# Altium schematic sheet Power.SchDoc
size A
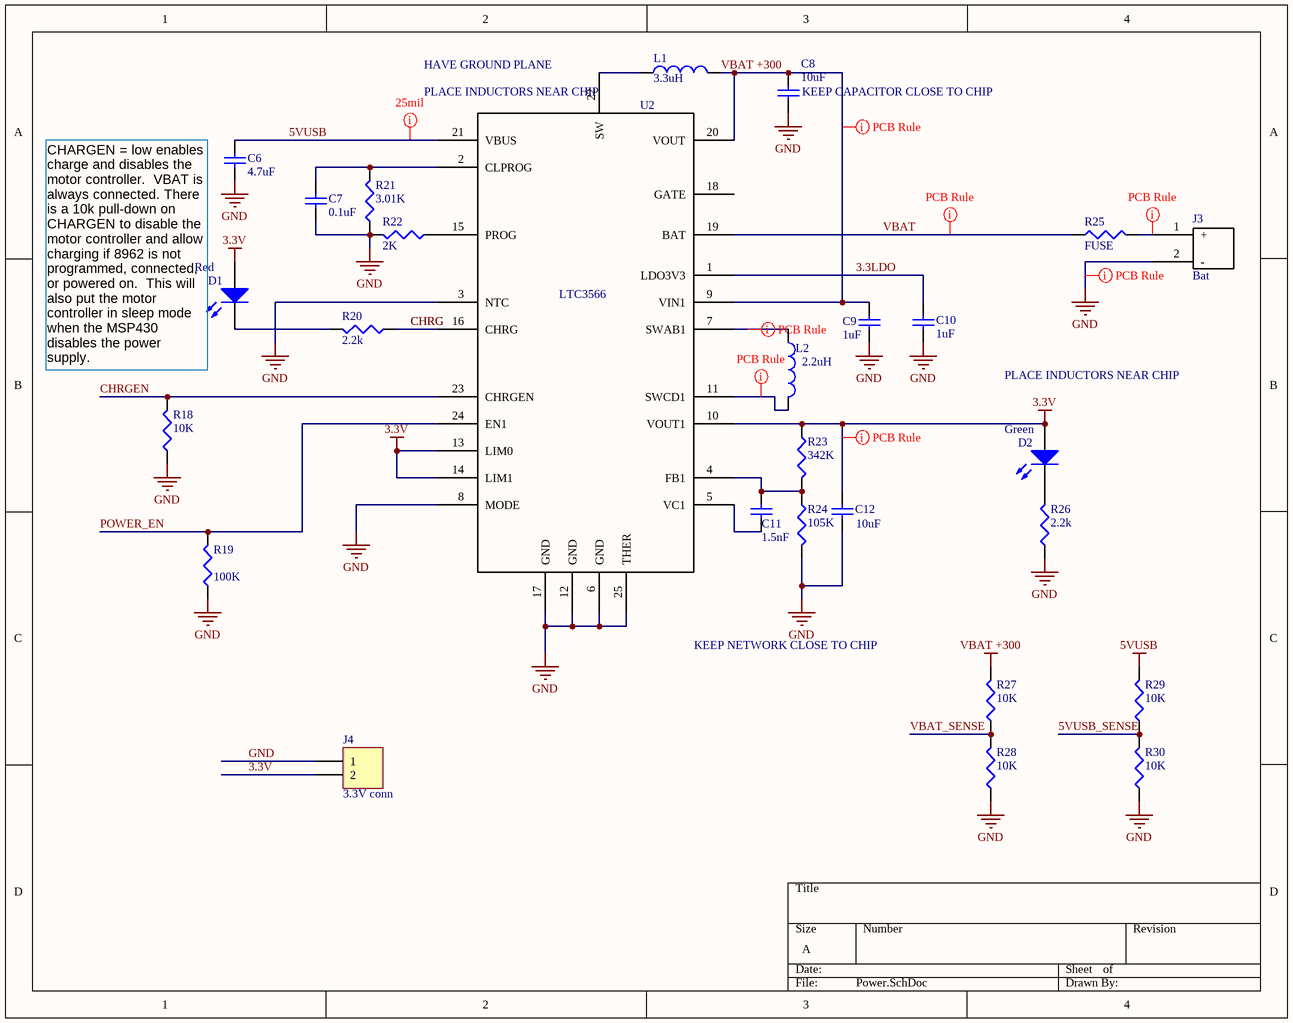
[diagram p0: Power.SchDoc]

## Parts
C6  value 4.7uF  [CAPC1608L]  (hidden comment: Cap)
C7  value 0.1uF  [CAPC1005L]  (hidden comment: Cap)
C8  value 10uF  [CAPC1608L]  (hidden comment: Cap)
C9  value 1uF  [CAPC1608L]  (hidden comment: Cap)
C10  value 1uF  [CAPC1608L]  (hidden comment: Cap)
C11  value 1.5nF  [CAPC1005L]  (hidden comment: Cap)
C12  value 10uF  [CAPC1608L]  (hidden comment: Cap)
D1  Red  [INDC2012L]
D2  Green  [INDC2012L]
J3  Bat  [BatteryConnJST]
J4  3.3V conn  [HDR1X2]
L1  3.3uH  [IndPow]
L2  2.2uH  [IndPow]
R18  value 10K  [RESC1608L]  (hidden comment: Res3)
R19  value 100K  [RESC1608L]  (hidden comment: Res3)
R20  value 2.2k  [RESC1608L]  (hidden comment: Res3)
R21  value 3.01K  [RESC1608L]  (hidden comment: Res3)
R22  value 2K  [RESC1608L]  (hidden comment: Res3)
R23  value 342K  [RESC1608L]  (hidden comment: Res3)
R24  value 105K  [RESC1608L]  (hidden comment: Res3)
R25  value FUSE  [RESC3225L]  (hidden comment: Res3)
R26  value 2.2k  [RESC1608L]  (hidden comment: Res3)
R27  value 10K  [RESC1608L]  (hidden comment: Res3)
R28  value 10K  [RESC1608L]  (hidden comment: Res3)
R29  value 10K  [RESC1608L]  (hidden comment: Res3)
R30  value 10K  [RESC1608L]  (hidden comment: Res3)
U2  LTC3566  [QFN-24]

## Nets
3.3V: C12.2 D1.1(A) D2.1(A) J4.2 R23.1 U2.10(VOUT1) U2.13(LIM0) U2.14(LIM1)
5VUSB: C6.2 R29.2 U2.21(VBUS)
GND: C6.1 C7.1 C8.1 C9.2 C10.2 C12.1 J3.2(-) J4.1 R18.1 R19.1 R21.1 R22.2 R24.2 R26.1 R28.1 R30.1 U2.3(NTC) U2.6(GND) U2.8(MODE) U2.12(GND) U2.17(GND) U2.25(THER)
VBAT +300: C8.2 C9.1 L1.2 R27.2 U2.9(VIN1) U2.20(VOUT)
3.3LDO: C10.1 U2.1(LDO3V3)
5VUSB_SENSE: R29.1 R30.2
CHRG: R20.1 U2.16(CHRG)
CHRGEN: R18.2 U2.23(CHRGEN)
POWER_EN: R19.2 U2.24(EN1)
VBAT: R25.1 U2.19(BAT)
VBAT_SENSE: R27.1 R28.2
NetC7_2: C7.2 R21.2 U2.2(CLPROG)
NetC11_1: C11.1 R23.2 R24.1 U2.4(FB1)
NetC11_2: C11.2 U2.5(VC1)
NetD1_2: D1.2(K) R20.2
NetD2_2: D2.2(K) R26.2
NetJ3_1: J3.1(+) R25.2
NetL1_1: L1.1 U2.22(SW)
NetL2_1: L2.1 U2.7(SWAB1)
NetL2_2: L2.2 U2.11(SWCD1)
NetR22_1: R22.1 U2.15(PROG)

Not connected (* = marked no-connect by the designer): U2 18(GATE)

## Layout directives
rule Width Constraint [Pref Width = 25mil    Min Width = 10mil    Max Width = 25mil]: 5VUSB, GND, NetJ3_1, NetL2_1, NetL2_2, VBAT +300
rule Width Constraint [Pref Width = 25mil    Min Width = 10mil    Max Width = 100mil]: 3.3V
rule Width Constraint [Pref Width = 25mil    Min Width = 10mil    Max Width = 50mil]: VBAT

## Notes on the sheet
- (near U2) HAVE GROUND PLANE
- (near U2) PLACE INDUCTORS NEAR CHIP
- (near C8) KEEP CAPACITOR CLOSE TO CHIP
- CHARGEN = low enables charge and disables the motor controller.  VBAT is always connected. There is a 10k pull-down on CHARGEN to disable the motor controller and allow charging if 8962 is not programmed, connected, or powered on.  This will also put the motor controller in sleep mode when the MSP430 disables the power supply.
- CHRG
- PLACE INDUCTORS NEAR CHIP
- KEEP NETWORK CLOSE TO CHIP

## Library data of the parts
C6-C12 = Cap: Capacitor; Published: 8-Jun-2000; LatestRevisionDate: 17-Jul-2002; LatestRevisionNote: Re-released for DXP Platform.; PackageReference: RAD-0.3; Publisher: Altium Limited
D1 D2 = LED2: Typical RED, GREEN, YELLOW, AMBER GaAs LED; Published: 8-Jun-2000; LatestRevisionDate: 17-Jul-2002; LatestRevisionNote: Re-released for DXP Platform.; PackageVersion: Feb-2002; PackageReference: 3.2X1.6X1.1; Publisher: Altium Limited
J3 = BatteryConnJST
J4 = Header 2: Header, 2-Pin; LatestRevisionDate: 17-Jul-2002; LatestRevisionNote: Re-released for DXP Platform.; Publisher: Altium Limited
L1 L2 = Inductor
  L1: Value: 3.3uH
  L2: Value: 2.2uH
R18-R30 = Res3: Resistor; Published: 8-Jun-2000; LatestRevisionDate: 29-May-2009; LatestRevisionNote: IPC-7351 Footprint Added.; PackageReference: J1-0603; Publisher: Altium Limited; PackageDescription: Chip Resistor